# Altium schematic sheet PowerSupply.SchDoc
size A3
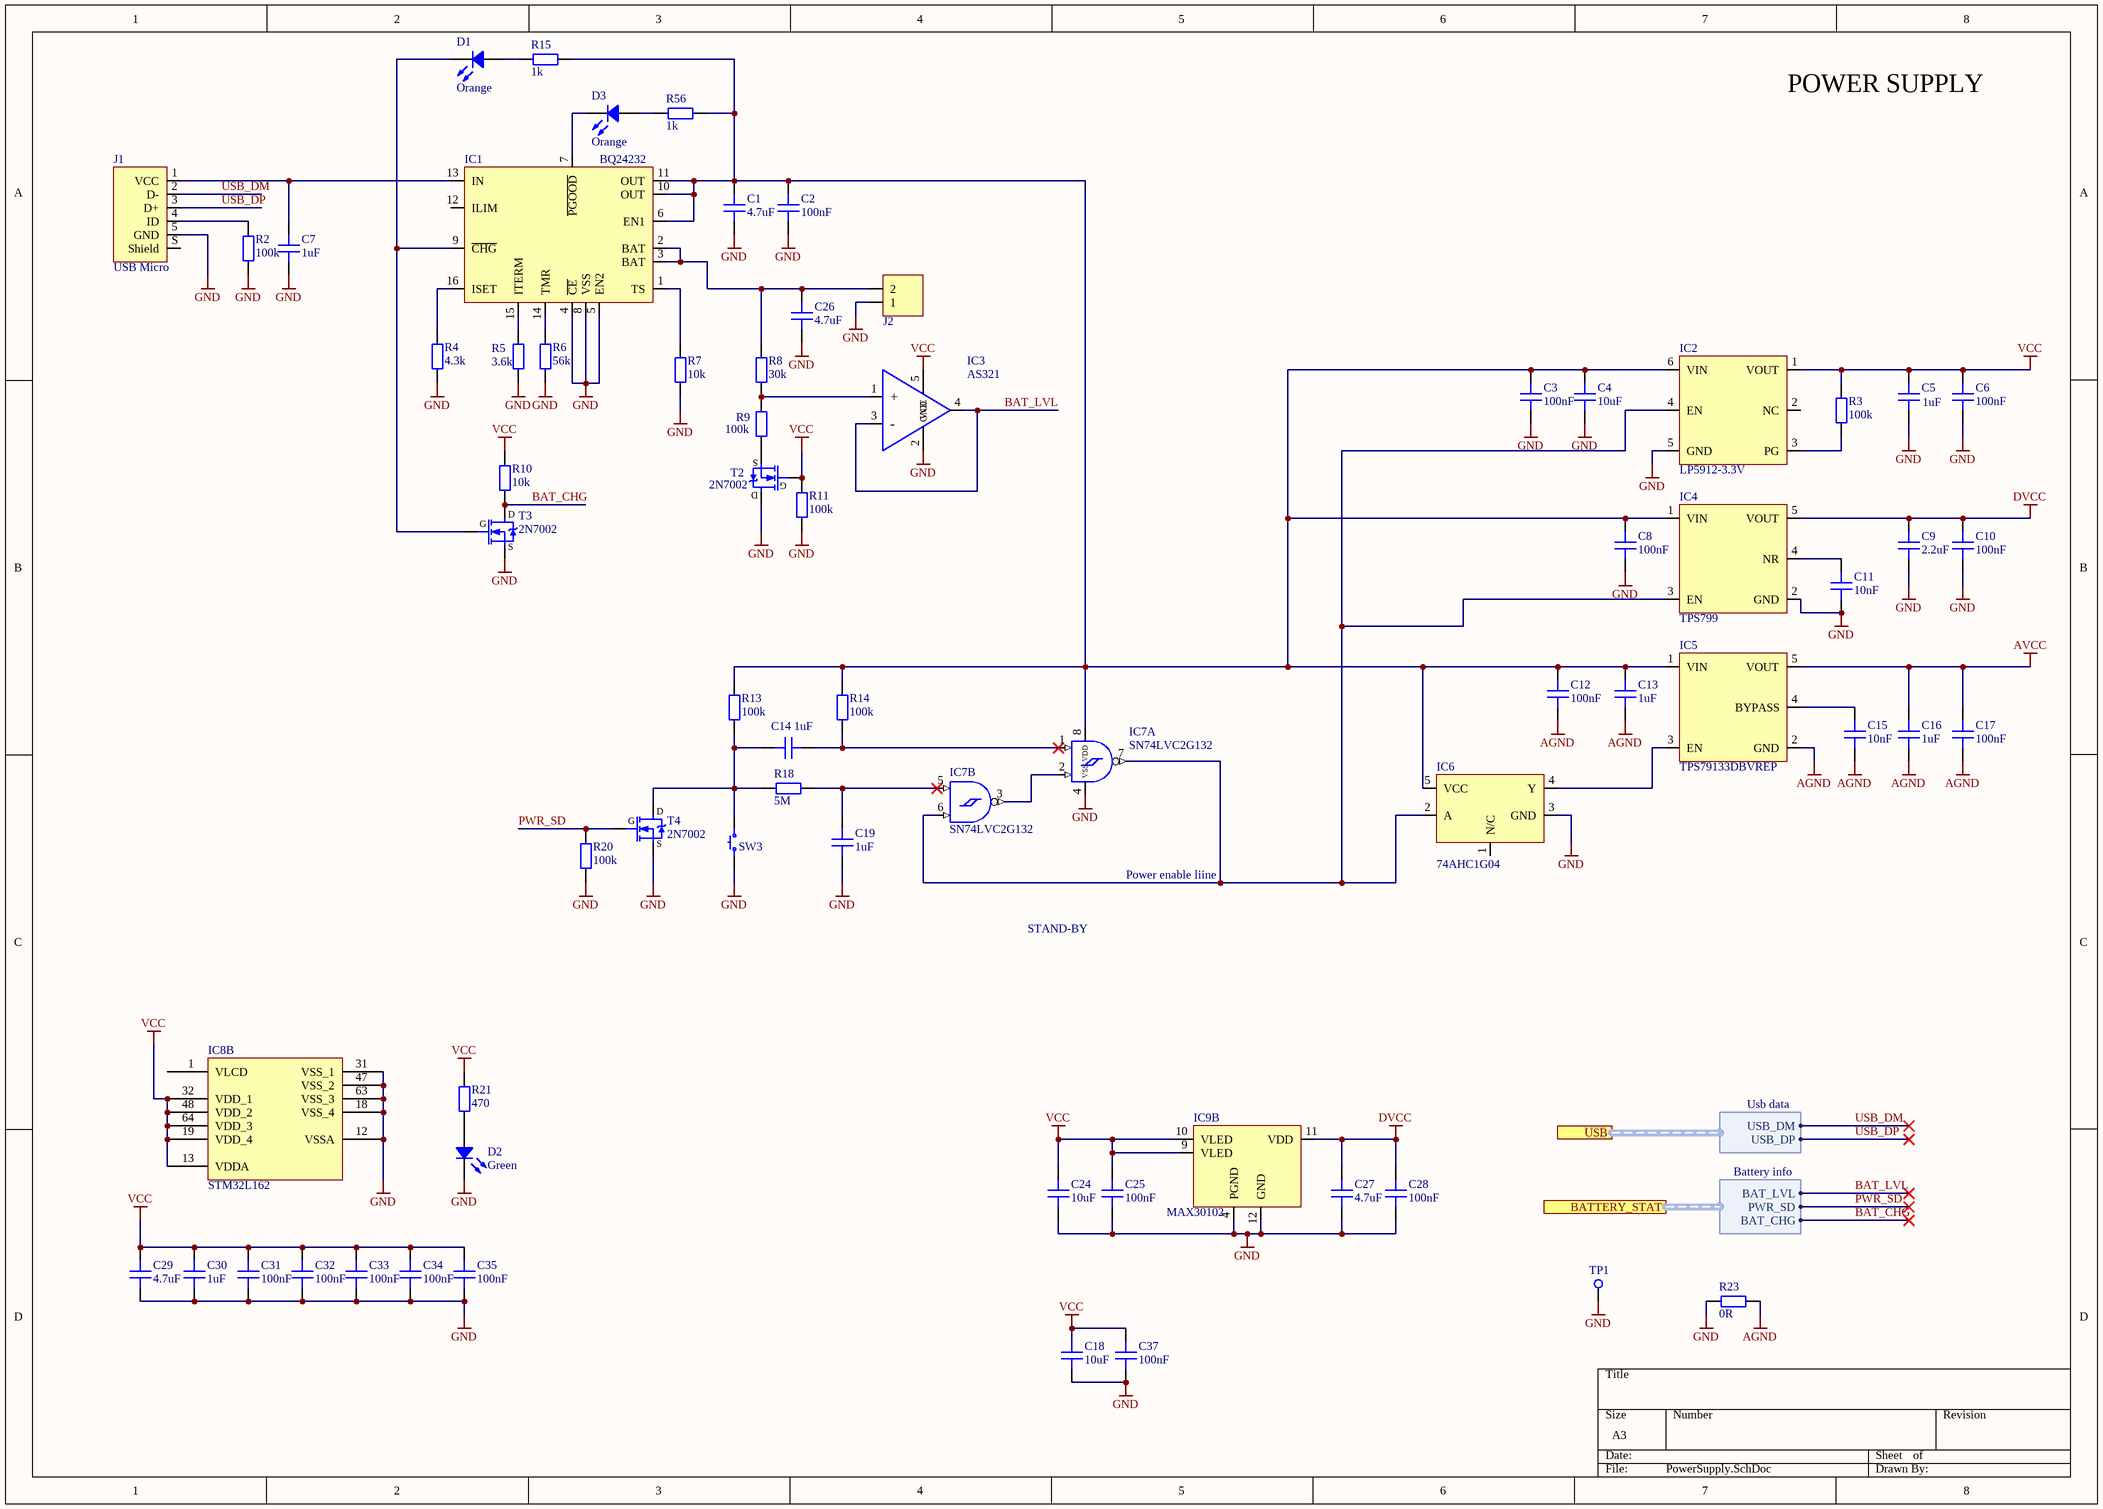
[diagram p0: PowerSupply.SchDoc]

## Parts
C1  4.7uF  [CAP 0603]
C2  100nF  [CAP 0603]
C3  100nF  [CAP 0603]
C4  10uF  [CAP 0603]
C5  1uF  [CAP 0603]
C6  100nF  [CAP 0603]
C7  1uF  [CAP 0603]
C8  100nF  [CAP 0603]
C9  2.2uF  [CAP 0603]
C10  100nF  [CAP 0603]
C11  10nF  [CAP 0603]
C12  100nF  [CAP 0603]
C13  1uF  [CAP 0603]
C14  1uF  [CAP 0603]
C15  10nF  [CAP 0603]
C16  1uF  [CAP 0603]
C17  100nF  [CAP 0603]
C18  10uF  [CAP 0603]
C19  1uF  [CAP 0603]
C24  10uF  [CAP 0603]
C25  100nF  [CAP 0603]
C26  4.7uF  [CAP 0603]
C27  4.7uF  [CAP 0603]
C28  100nF  [CAP 0603]
C29  4.7uF  [CAP 0603]
C30  1uF  [CAP 0603]
C31  100nF  [CAP 0603]
C32  100nF  [CAP 0603]
C33  100nF  [CAP 0603]
C34  100nF  [CAP 0603]
C35  100nF  [CAP 0603]
C37  100nF  [CAP 0603]
D1  Orange  [LED 0603]
D2  Green  [LED 0603]
D3  Orange  [LED 0603]
IC1  BQ24232  [QFN16]
IC2  LP5912-3.3V  [WSON 6]
IC3  AS321  [SOT23, 5-Leads]
IC4  TPS799  [SOT23, 5-Leads]
IC5  TPS79133DBVREP  [SOT23, 5-Leads]
IC6  74AHC1G04  [TSSOP5]
IC7  SN74LVC2G132  [TSSOP8]  (parts A,B of 2)
IC8  STM32L162  [LQFP64_L]  (part B of 3)
IC9  MAX30102  [MAX30102]  (part B of 2)
J1  USB Micro  [FCI USB 10118193-0001LF]
J2  2 pin  [HDR 1x2 2.54]  (value not drawn)
R2  100k  [RES 0603]
R3  100k  [RES 0603]
R4  4.3k  [RES 0603]
R5  3.6k  [RES 0603]
R6  56k  [RES 0603]
R7  10k  [RES 0603]
R8  30k  [RES 0603]
R9  100k  [RES 0603]
R10  10k  [RES 0603]
R11  100k  [RES 0603]
R13  100k  [RES 0603]
R14  100k  [RES 0603]
R15  1k  [RES 0603]
R18  5M  [RES 0603]
R20  100k  [RES 0603]
R21  470  [RES 0603]
R23  0R  [RES 0603]
R56  1k  [RES 0603]
SW3  BUTTON-NO  [SW OMRON]  (value not drawn)
T2  2N7002  [SOT23]
T3  2N7002  [SOT23]
T4  2N7002  [SOT23]
TP1  Test Point  [TP THT 48MILS]  (value not drawn)

## Ports
BATTERY_STAT (harness Battery info), USB (harness Usb data)

## Harnesses
Battery info: BAT_LVL, PWR_SD, BAT_CHG
Usb data: USB_DM, USB_DP

## Nets
AGND: C12.1 C13.1 C15.1 C16.1 C17.1 IC5.2(GND) R23.1
AVCC: C16.2 C17.2 IC5.5(VOUT)
DVCC: C9.2 C10.2 C27.2 C28.2 IC4.5(VOUT) IC9.11(VDD)
GND: C1.1 C2.1 C3.1 C4.1 C5.1 C6.1 C7.1 C8.1 C9.1 C10.1 C11.1 C18.1 C19.1 C24.1 C25.1 C26.1 C27.1 C28.1 C29.1 C30.1 C31.1 C32.1 C33.1 C34.1 C35.1 C37.1 D2.2 IC1.4(~{CE}) IC1.5(EN2) IC1.8(VSS) IC2.5(GND) IC3.2(GND) IC4.2(GND) IC6.3(GND) IC7.4(VSS) IC8.12(VSSA) IC8.18(VSS_4) IC8.31(VSS_1) IC8.47(VSS_2) IC8.63(VSS_3) IC9.4(PGND) IC9.12(GND) J1.5(GND) J2.1 R2.1 R4.1 R5.1 R6.1 R7.1 R11.1 R20.1 R23.2 SW3.2 T2.3(D) T3.2(S) T4.2(S) TP1.1(TP)
VCC: C5.2 C6.2 C18.2 C24.2 C25.2 C29.2 C30.2 C31.2 C32.2 C33.2 C34.2 C35.2 C37.2 IC2.1(VOUT) IC3.5(VCC) IC8.13(VDDA) IC8.19(VDD_4) IC8.32(VDD_1) IC8.48(VDD_2) IC8.64(VDD_3) IC9.9(VLED) IC9.10(VLED) R3.2 R10.2 R11.2 R21.2 T2.1(G)
BAT_CHG: R10.1 T3.3(D) ; port BATTERY_STAT.BAT_CHG
BAT_LVL: IC3.3(-) IC3.4(OUT) ; port BATTERY_STAT.BAT_LVL
PWR_SD: R20.2 T4.1(G) ; port BATTERY_STAT.PWR_SD
USB_DM: J1.2(D-) ; port USB.USB_DM
USB_DP: J1.3(D+) ; port USB.USB_DP
NetC1_2: C1.2 C2.2 C3.2 C4.2 C8.2 C12.2 C13.2 IC1.6(EN1) IC1.10(OUT) IC1.11(OUT) IC2.6(VIN) IC4.1(VIN) IC5.1(VIN) IC6.5(VCC) IC7.8(VDD) R13.2 R14.2 R15.1 R56.2
NetC7_2: C7.2 IC1.13(IN) J1.1(VCC)
NetC11_2: C11.2 IC4.4(NR)
NetC14_1: C14.1 R13.1 R18.2 SW3.1 T4.3(D)
NetC14_2: C14.2 IC7.1(A) R14.1
NetC15_2: C15.2 IC5.4(BYPASS)
NetC19_2: C19.2 IC7.5(A) R18.1
NetC26_2: C26.2 IC1.2(BAT) IC1.3(BAT) J2.2 R8.2
NetD1_1: D1.1 R15.2
NetD1_2: D1.2 IC1.9(~{CHG}) T3.1(G)
NetD2_1: D2.1 R21.1
NetD3_1: D3.1 R56.1
NetD3_2: D3.2 IC1.7(~{PGOOD})
NetIC1_1: IC1.1(TS) R7.2
NetIC1_14: IC1.14(TMR) R6.2
NetIC1_15: IC1.15(ITERM) R5.2
NetIC1_16: IC1.16(ISET) R4.2
NetIC2_3: IC2.3(PG) R3.1
NetIC2_4: IC2.4(EN) IC4.3(EN) IC6.2(A) IC7.6(B) IC7.7(Y)
NetIC3_1: IC3.1(+) R8.1 R9.2
NetIC5_3: IC5.3(EN) IC6.4(Y)
NetIC7_2: IC7.2(B) IC7.3(Y)
NetJ1_4: J1.4(ID) R2.2
NetR9_1: R9.1 T2.2(S)

Not connected (* = marked no-connect by the designer): IC1 12(ILIM); IC2 2(NC); IC6 1(N/C); IC8 1(VLCD); J1 S(Shield)

## Notes on the sheet
- POWER SUPPLY
- Power enable liine
- STAND-BY

## Library data of the parts
C1-C19 C24-C35 C37 = Capacitor: SMT Capacitor
  C1 C26 C27 C29: Value: 4.7uF
  C2 C3 C6 C8 C10 C12 C17 C25 C28 C31-C35 C37: Value: 100nF
  C4 C18 C24: Value: 10uF
  C5 C7 C13 C14 C16 C19 C30: Value: 1uF
  C9: Value: 2.2uF
  C11 C15: Value: 10nF
D1-D3 = LED: Chip LED
  D1 D3: Value: Orange
  D2: Value: Green
IC1 = TI BQ24232: USB Friendly 0.5A Li+ Charger w/ Dynamic Power Management
IC2 = TI LP5912-3.3V: 50 mA, 3 V TO 50 V, MICROPOWER, LOW-DROPOUT LINEAR REGULATOR
IC3 = AS321: Op amp
IC4 = TI TPS799: TPS799 200-mA, Low-Quiescent Current, Ultralow Noise, High-PSRR Low-Dropout Linear  Regulator
IC5 = TI TPS79133DBVREP: ULTRALOW NOISE, HIGH PSRR, FAST RF, 100-mA  LOW-DROPOUT LINEAR REGULATORS
IC6 = 74AHC1G04: Inverter
IC7 = SN74LVC2G132: Dual 2-Input NAND Gate With Schmitt-Trigger Inputs; Value: SN74LVC2G132
IC8 = STM32L162: STM32 ARM-based 32-bit MCU with 32 Kbytes Flash, 64-pin LQFP; Value: STM32L162RDT; ComponentLink1Description: http://www.st.com/content/ccc/resource/technical/document/datasheet/ee/d5/84/2b/a9/ae/44/3d/DM00039232.pdf/files/DM00039232.pdf/jcr:content/translations/en.DM00039232.pdf; ComponentLink1URL: http://www.st.com/stonline/products/literature/ds/13586.pdf; Package: LQFP64
IC9 = MAX30102: Pulse Oximeter and Heart-Rate Sensor
J1 = USB 2.0 Type B Micro: Micro usb
J2 = 2 pin: 2 pin header, male
R2-R11 R13-R15 R18 R20 R21 R23 R56 = Resistor: SMDResistor
  R2 R3 R9 R11 R13 R14 R20: Value: 100k
  R4: Value: 4.3k
  R5: Value: 3.6k
  R6: Value: 56k
  R7 R10: Value: 10k
  R8: Value: 30k
  R15 R56: Value: 1k
  R18: Value: 5M
  R21: Value: 470
  R23: Value: 0R
SW3 = BUTTON-NO 2 PIN Small: Button, SMD, Small, 2.5x3mm
T2-T4 = N-MOSFET: Unipolar transistor N-MOSFET; Value: 2N7002